# Altium schematic sheet Rs485_Bus_Interface.SchDoc
size A4
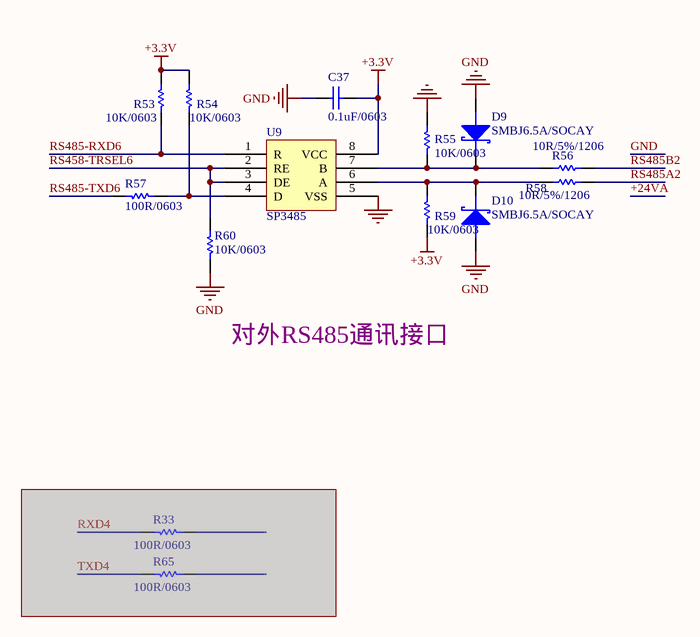
[diagram p0: Rs485_Bus_Interface.SchDoc]

## Parts
C37  0.1uF/0603  [CAP/SMT/0603C]
D9  SMBJ6.5A/SOCAY  [D/SMT/SMBJ4.0A]
D10  SMBJ6.5A/SOCAY  [D/SMT/SMBJ4.0A]
R33  100R/0603  [0603R]  (masked out: inside a compile mask, not in the netlist)
R53  10K/0603  [0603R]
R54  10K/0603  [0603R]
R55  10K/0603  [0603R]
R56  10R/5%/1206  [1206R]
R57  100R/0603  [0603R]
R58  10R/5%/1206  [1206R]
R59  10K/0603  [0603R]
R60  10K/0603  [0603R]
R65  100R/0603  [0603R]  (masked out: inside a compile mask, not in the netlist)
U9  SP3485  [SOP-8]

## Nets
+3.3V: C37.2 R53.2 R54.2 R59.2 U9.8(VCC)
GND: C37.1 D9.1(K) D10.1(K) R55.1 R60.1 U9.5(VSS)
RS458-TRSEL6: R60.2 U9.2(RE) U9.3(DE)
RS485-RXD6: R53.1 U9.1(R)
RS485-TXD6: R57.2
RS485A2: R58.2
RS485B2: R56.2
NetD9_2: D9.2(A) R55.2 R56.1 U9.7(B)
NetD10_2: D10.2(A) R58.1 R59.1 U9.6(A)
NetR54_1: R54.1 R57.1 U9.4(D)

## Notes on the sheet
- Labels drawn without touching a wire or pin: 对外RS485通讯接口

## Library data of the parts
C37 = CAP/CAP/SMT/0603C
D9 D10 = D/TVS/SMT/SMBJ6.5A/DO-214
R33 R53-R55 R57 R59 R60 R65 = Res1: Resistor; Manufacturer: Generic Components; Class: Passive; Value: 1K; Published: 08/06/2000; Publisher: Altium Hobart Technology Centre; SubClass: Resistor
R56 R58 = RES/RES/SMT/1206
U9 = MAX487